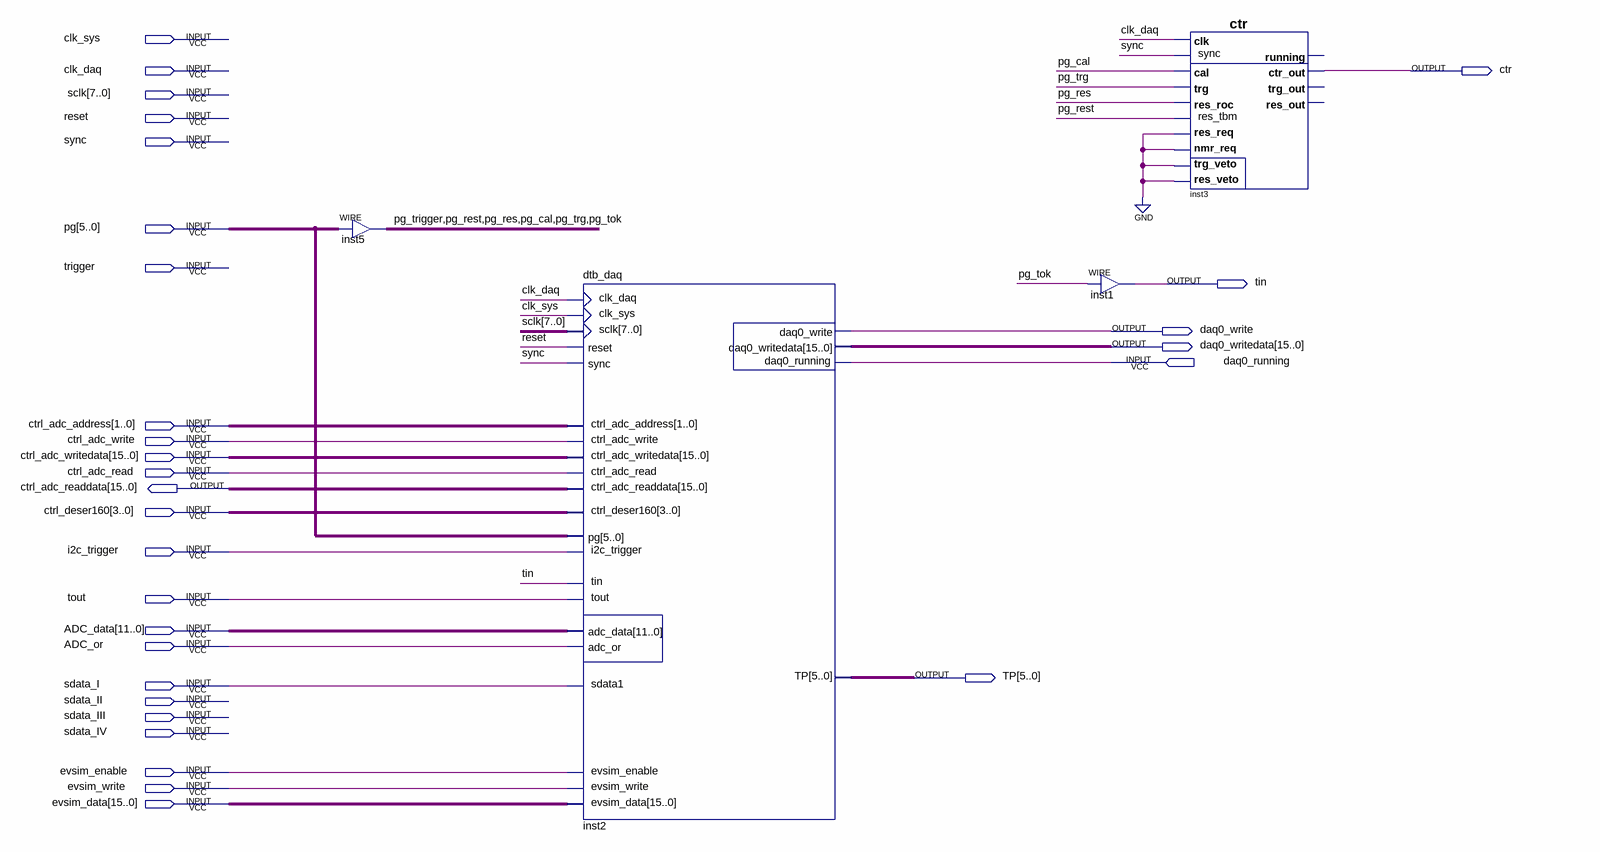
[diagram p0: schematic sheet]
// Quartus schematic data_aqu.bdf as structural Verilog: 4 symbols, 30 pins
module data_aqu (
  input  clk_sys,
  input  clk_daq,
  input  [7:0] sclk,
  input  reset,
  input  sync,
  input  [5:0] pg,
  input  trigger,
  input  daq0_running,
  input  [1:0] ctrl_adc_address,
  input  ctrl_adc_write,
  input  [15:0] ctrl_adc_writedata,
  input  ctrl_adc_read,
  input  [3:0] ctrl_deser160,
  input  i2c_trigger,
  input  tout,
  input  [11:0] ADC_data,
  input  ADC_or,
  input  sdata_I,
  input  sdata_II,
  input  sdata_III,
  input  sdata_IV,
  input  evsim_enable,
  input  evsim_write,
  input  [15:0] evsim_data,
  output ctr,
  output tin,
  output daq0_write,
  output [15:0] daq0_writedata,
  output [15:0] ctrl_adc_readdata,
  output [5:0] TP
);

  wire pg_cal, pg_res, pg_rest, pg_tok, pg_trg, pg_trigger;

  assign {pg_trigger, pg_rest, pg_res, pg_cal, pg_trg, pg_tok} = pg;  // WIRE inst5
  dtb_daq inst2 (
    .clk_daq(clk_daq), .clk_sys(clk_sys), .reset(reset), .sync(sync), .pg(pg), .adc_data(ADC_data),
    .adc_or(ADC_or), .tin(tin), .tout(tout), .sdata1(sdata_I), .ctrl_deser160(ctrl_deser160), .sclk(sclk),
    .daq0_running(daq0_running), .ctrl_adc_address(ctrl_adc_address), .ctrl_adc_write(ctrl_adc_write),
    .ctrl_adc_read(ctrl_adc_read), .ctrl_adc_writedata(ctrl_adc_writedata), .i2c_trigger(i2c_trigger),
    .evsim_data(evsim_data), .evsim_write(evsim_write), .evsim_enable(evsim_enable), .daq0_write(daq0_write),
    .daq0_writedata(daq0_writedata), .ctrl_adc_readdata(ctrl_adc_readdata), .TP(TP));
  assign tin = pg_tok;  // WIRE inst1
  ctr inst3 (
    .res_veto(1'b0), .trg_veto(1'b0), .clk(clk_daq), .trg(pg_trg), .cal(pg_cal), .res_req(1'b0),
    .nmr_req(1'b0), .sync(sync), .res_tbm(pg_rest), .res_roc(pg_res), .ctr_out(ctr));  // open: running, trg_out, res_out
endmodule
